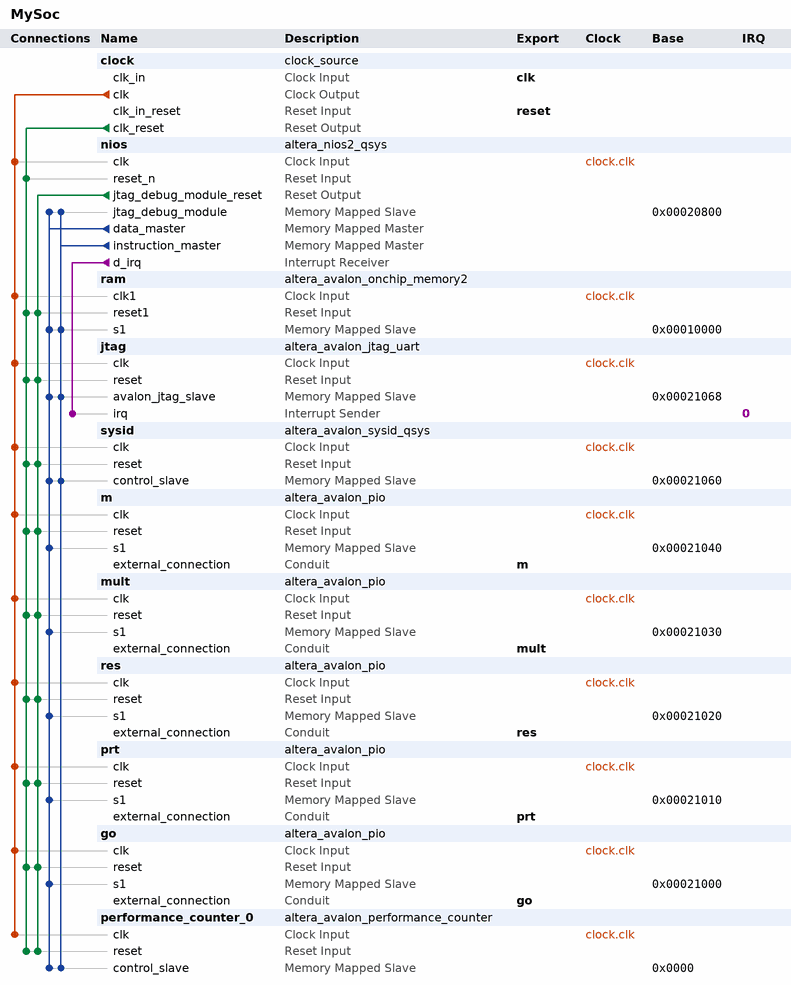
[diagram p0: system contents]
# Platform Designer (Qsys) system MySoc, Cyclone III EP3C25F324C6
# Parameters at their usual value, and those the tool derives, are not listed.
package require -exact qsys 13.0.1.99.2
create_system MySoc
set_project_property DEVICE_FAMILY {Cyclone III}
set_project_property DEVICE EP3C25F324C6

add_instance clock clock_source 13.0
set_instance_parameter_value clock clockFrequency 50000000

add_instance nios altera_nios2_qsys 13.0
set_instance_parameter_value nios resetSlave ram.s1
set_instance_parameter_value nios mmu_TLBMissExcSlave None
set_instance_parameter_value nios exceptionSlave ram.s1
set_instance_parameter_value nios breakSlave nios.jtag_debug_module
set_instance_parameter_value nios impl Tiny
set_instance_parameter_value nios icache_size 4096

add_instance ram altera_avalon_onchip_memory2 13.0.1.99.2
set_instance_parameter_value ram dataWidth 32
set_instance_parameter_value ram dualPort false
set_instance_parameter_value ram initMemContent true
set_instance_parameter_value ram initializationFileName onchip_mem.hex
set_instance_parameter_value ram memorySize 40960

add_instance jtag altera_avalon_jtag_uart 13.0.1.99.2
set_instance_parameter_value jtag simInteractiveOptions NO_INTERACTIVE_WINDOWS

add_instance sysid altera_avalon_sysid_qsys 13.0
set_instance_parameter_value sysid id 0

add_instance m altera_avalon_pio 13.0.1.99.2
set_instance_parameter_value m direction Output
set_instance_parameter_value m width 6

add_instance mult altera_avalon_pio 13.0.1.99.2
set_instance_parameter_value mult direction Output
set_instance_parameter_value mult width 6

add_instance res altera_avalon_pio 13.0.1.99.2
set_instance_parameter_value res direction Input
set_instance_parameter_value res width 12

add_instance prt altera_avalon_pio 13.0.1.99.2
set_instance_parameter_value prt direction Input
set_instance_parameter_value prt width 1

add_instance go altera_avalon_pio 13.0.1.99.2
set_instance_parameter_value go direction Output
set_instance_parameter_value go width 1

add_instance performance_counter_0 altera_avalon_performance_counter 13.0.1.99.2
set_instance_parameter_value performance_counter_0 numberOfSections 3

# connections
add_connection clock.clk go.clk clock
add_connection clock.clk jtag.clk clock
add_connection clock.clk m.clk clock
add_connection clock.clk mult.clk clock
add_connection clock.clk nios.clk clock
add_connection clock.clk performance_counter_0.clk clock
add_connection clock.clk prt.clk clock
add_connection clock.clk ram.clk1 clock
add_connection clock.clk res.clk clock
add_connection clock.clk sysid.clk clock
add_connection clock.clk_reset go.reset reset
add_connection clock.clk_reset jtag.reset reset
add_connection clock.clk_reset m.reset reset
add_connection clock.clk_reset mult.reset reset
add_connection clock.clk_reset nios.reset_n reset
add_connection clock.clk_reset performance_counter_0.reset reset
add_connection clock.clk_reset prt.reset reset
add_connection clock.clk_reset ram.reset1 reset
add_connection clock.clk_reset res.reset reset
add_connection clock.clk_reset sysid.reset reset
add_connection nios.jtag_debug_module_reset go.reset reset
add_connection nios.jtag_debug_module_reset jtag.reset reset
add_connection nios.jtag_debug_module_reset m.reset reset
add_connection nios.jtag_debug_module_reset mult.reset reset
add_connection nios.jtag_debug_module_reset performance_counter_0.reset reset
add_connection nios.jtag_debug_module_reset prt.reset reset
add_connection nios.jtag_debug_module_reset ram.reset1 reset
add_connection nios.jtag_debug_module_reset res.reset reset
add_connection nios.jtag_debug_module_reset sysid.reset reset
add_connection nios.data_master go.s1 avalon
set_connection_parameter_value nios.data_master/go.s1 baseAddress 0x00021000
add_connection nios.data_master jtag.avalon_jtag_slave avalon
set_connection_parameter_value nios.data_master/jtag.avalon_jtag_slave baseAddress 0x00021068
add_connection nios.data_master m.s1 avalon
set_connection_parameter_value nios.data_master/m.s1 baseAddress 0x00021040
add_connection nios.data_master mult.s1 avalon
set_connection_parameter_value nios.data_master/mult.s1 baseAddress 0x00021030
add_connection nios.data_master nios.jtag_debug_module avalon
set_connection_parameter_value nios.data_master/nios.jtag_debug_module baseAddress 0x00020800
add_connection nios.data_master performance_counter_0.control_slave avalon
set_connection_parameter_value nios.data_master/performance_counter_0.control_slave baseAddress 0x0000
add_connection nios.data_master prt.s1 avalon
set_connection_parameter_value nios.data_master/prt.s1 baseAddress 0x00021010
add_connection nios.data_master ram.s1 avalon
set_connection_parameter_value nios.data_master/ram.s1 baseAddress 0x00010000
add_connection nios.data_master res.s1 avalon
set_connection_parameter_value nios.data_master/res.s1 baseAddress 0x00021020
add_connection nios.data_master sysid.control_slave avalon
set_connection_parameter_value nios.data_master/sysid.control_slave baseAddress 0x00021060
add_connection nios.instruction_master jtag.avalon_jtag_slave avalon
set_connection_parameter_value nios.instruction_master/jtag.avalon_jtag_slave baseAddress 0x00021068
add_connection nios.instruction_master nios.jtag_debug_module avalon
set_connection_parameter_value nios.instruction_master/nios.jtag_debug_module baseAddress 0x00020800
add_connection nios.instruction_master performance_counter_0.control_slave avalon
set_connection_parameter_value nios.instruction_master/performance_counter_0.control_slave baseAddress 0x0000
add_connection nios.instruction_master ram.s1 avalon
set_connection_parameter_value nios.instruction_master/ram.s1 baseAddress 0x00010000
add_connection nios.instruction_master sysid.control_slave avalon
set_connection_parameter_value nios.instruction_master/sysid.control_slave baseAddress 0x00021060
add_connection nios.d_irq jtag.irq interrupt
set_connection_parameter_value nios.d_irq/jtag.irq irqNumber 0

# exported interfaces
add_interface clk clock sink
set_interface_property clk EXPORT_OF clock.clk_in
add_interface reset reset sink
set_interface_property reset EXPORT_OF clock.clk_in_reset
add_interface go conduit end
set_interface_property go EXPORT_OF go.external_connection
add_interface prt conduit end
set_interface_property prt EXPORT_OF prt.external_connection
add_interface res conduit end
set_interface_property res EXPORT_OF res.external_connection
add_interface mult conduit end
set_interface_property mult EXPORT_OF mult.external_connection
add_interface m conduit end
set_interface_property m EXPORT_OF m.external_connection

set_interconnect_requirement {$system} qsys_mm.clockCrossingAdapter HANDSHAKE
set_interconnect_requirement {$system} qsys_mm.maxAdditionalLatency 1

save_system MySoc.qsys
